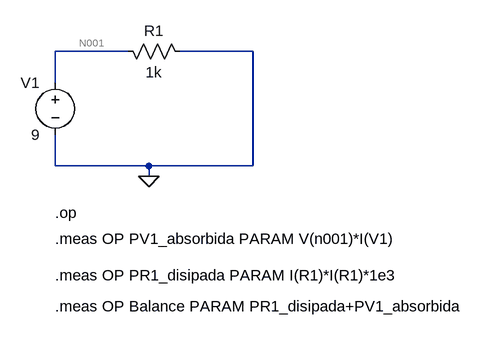
[diagram p0: schematic semana1_01_ohm_basico.asc]
semana1_01_ohm_basico.asc, the LTspice schematic file:
Version 4
SHEET 1 880 680
WIRE -784 -80 -896 -80
WIRE -592 -80 -704 -80
WIRE -896 -32 -896 -80
WIRE -896 96 -896 48
WIRE -752 96 -896 96
WIRE -592 96 -592 -80
WIRE -592 96 -752 96
WIRE -752 112 -752 96
FLAG -752 112 0
SYMBOL voltage -896 -48 M0
WINDOW 123 0 0 Left 0
WINDOW 39 0 0 Left 0
SYMATTR InstName V1
SYMATTR Value 9
SYMBOL res -800 -96 M90
WINDOW 0 0 56 VBottom 2
WINDOW 3 32 56 VTop 2
SYMATTR InstName R1
SYMATTR Value 1k
TEXT -896 168 Left 2 !.op
TEXT -896 208 Left 2 !.meas OP PV1_absorbida PARAM V(n001)*I(V1)
TEXT -896 264 Left 2 !.meas OP PR1_disipada PARAM I(R1)*I(R1)*1e3
TEXT -896 312 Left 2 !.meas OP Balance PARAM PR1_disipada+PV1_absorbida

The netlist it stands for:
* semana1_01_ohm_basico.asc
V1 N001 0 9
R1 N001 0 1k
.op
.meas OP PV1_absorbida PARAM V(n001)*I(V1)
.meas OP PR1_disipada PARAM I(R1)*I(R1)*1e3
.meas OP Balance PARAM PR1_disipada+PV1_absorbida
.backanno
.end